# EasyEDA Pro project EasyEDA NeuroHab CS Module Project.epro

# Schematic Schematic1
Board Name: Board1; Create Date: 2025-11-24; Page Name: P1; Project Name: NH-AI CS Module; Schematic Name: Schematic1; Update Date: 2025-11-24; Company: EasyEDA.com; Page Size: A4; Version: V1.0
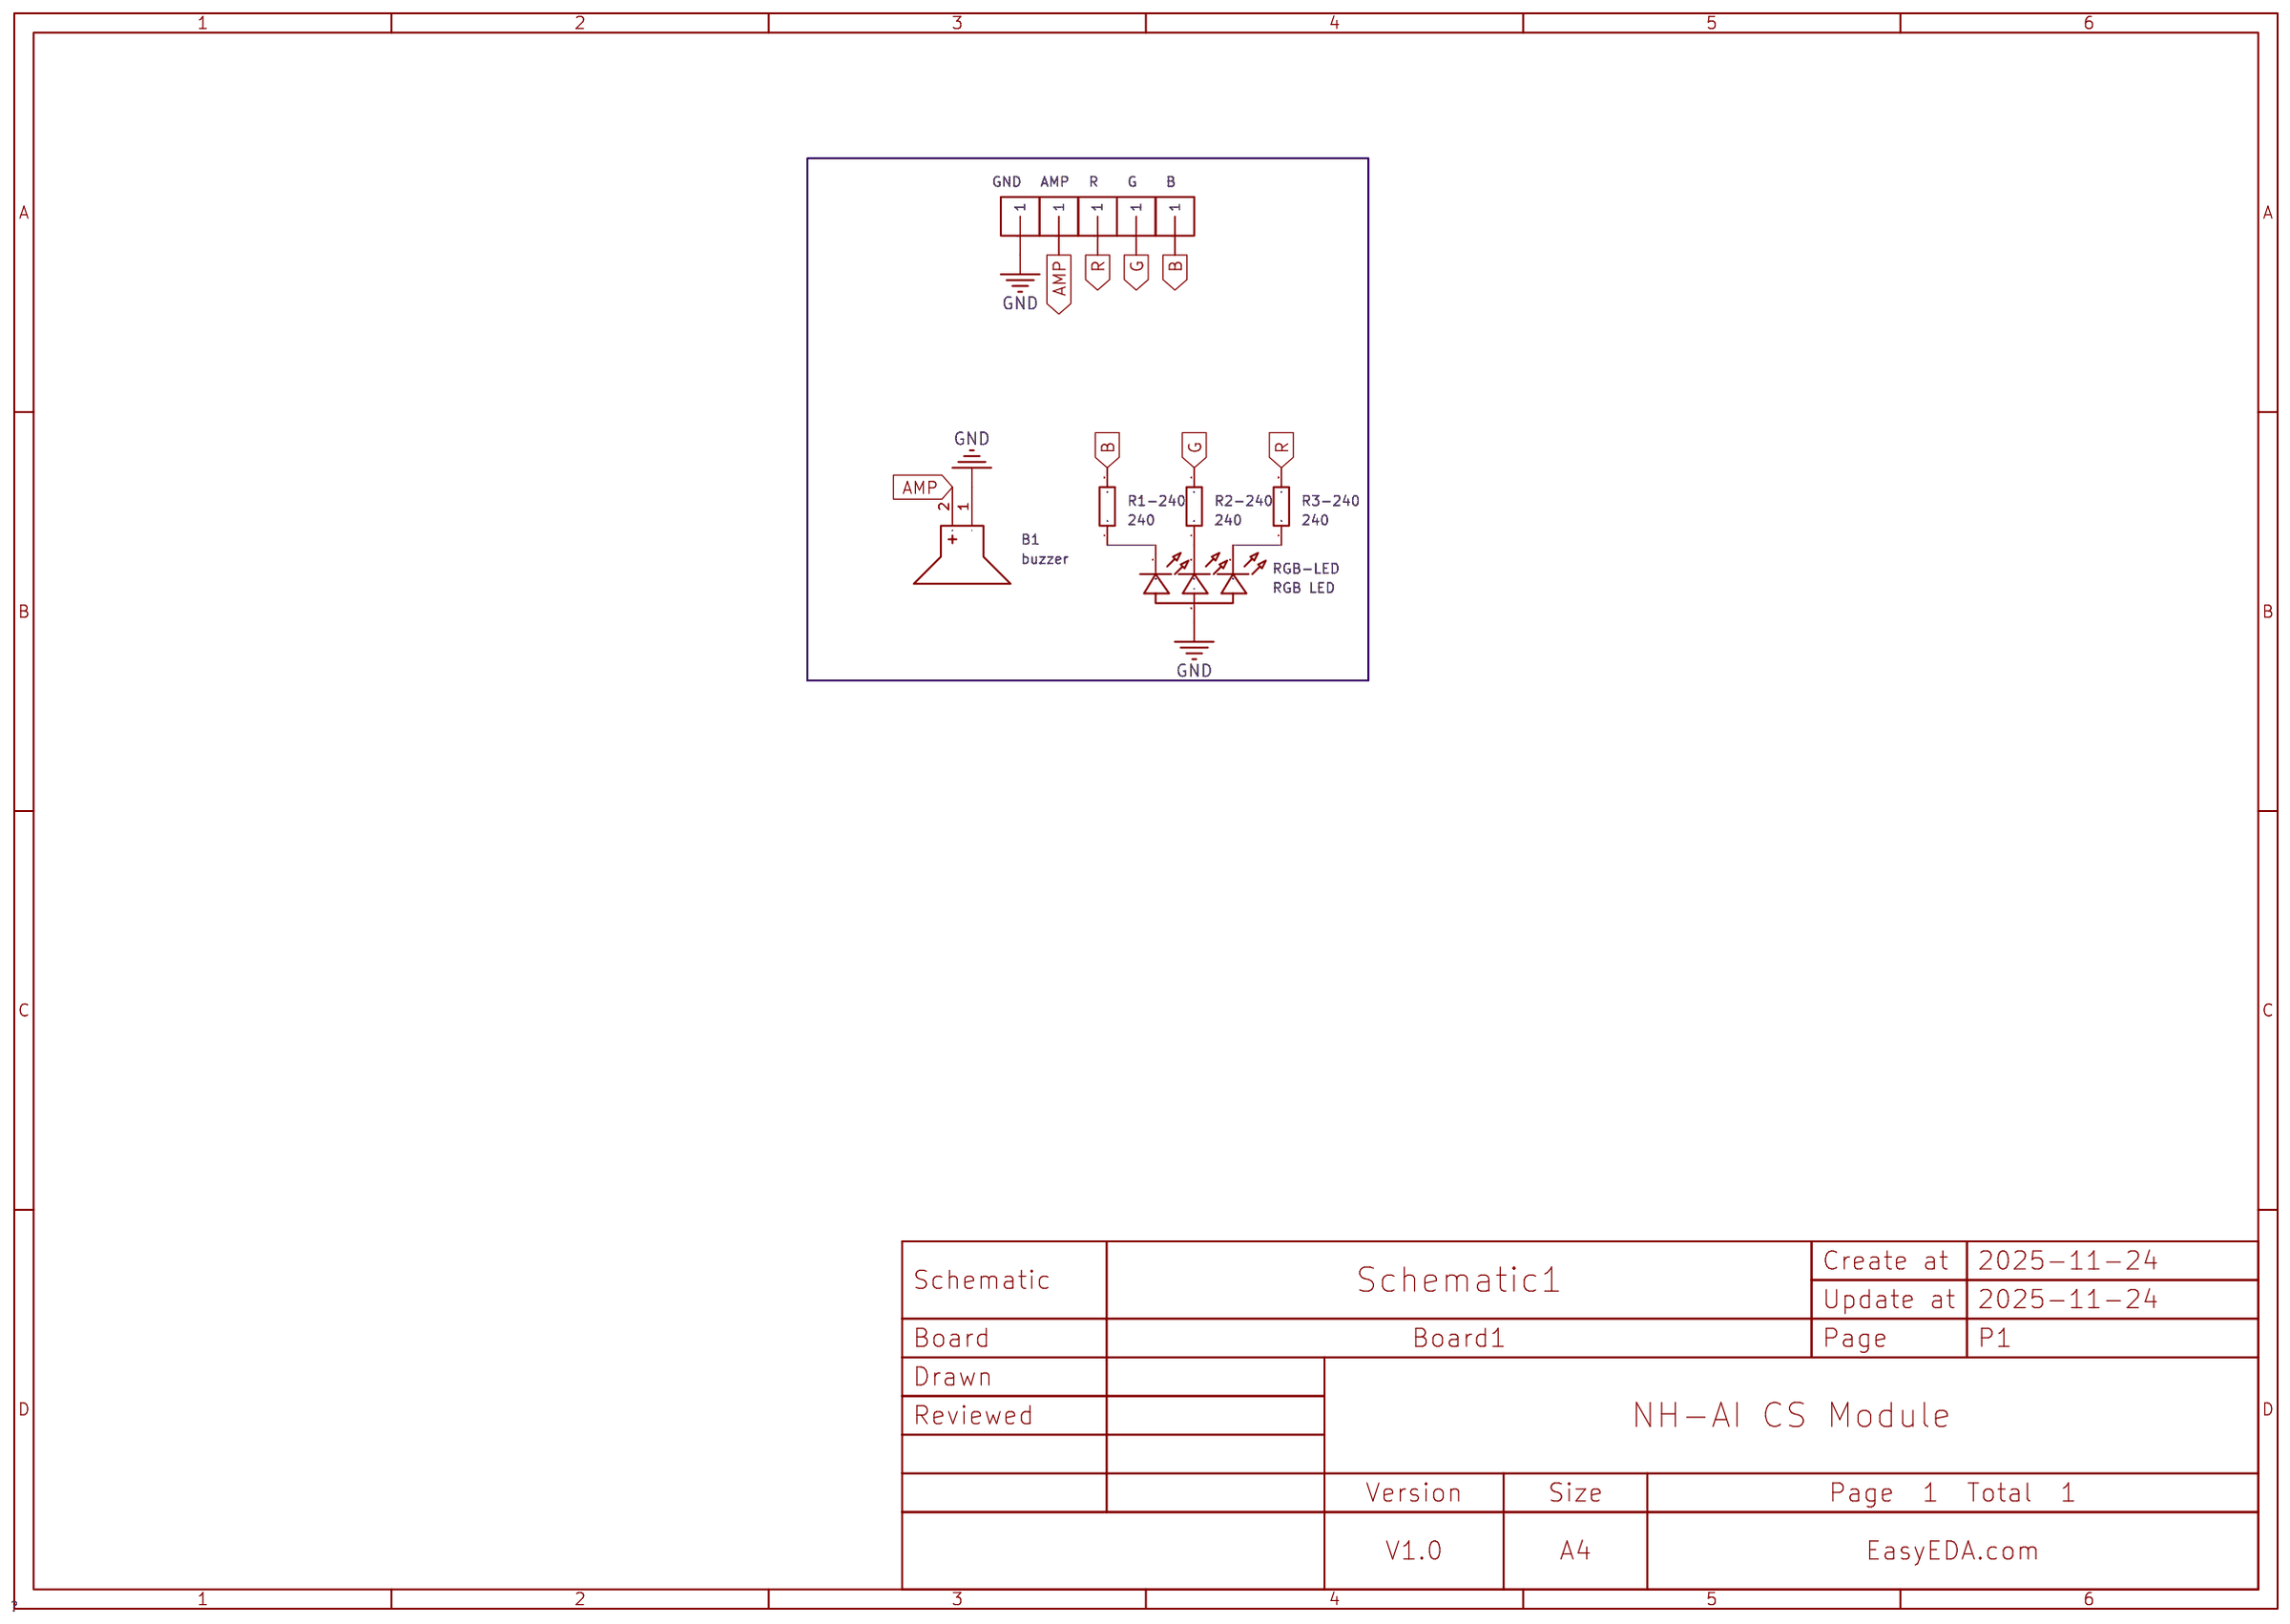
[diagram p0: schematic sheet]

## Parts
AMP  -  [2.54mm Screw Terminal]
B  -  [2.54mm Screw Terminal]
B1  buzzer  [BUZ-TH_BD12.0-P6.00-D0.9-RD]
G  -  [2.54mm Screw Terminal]
GND  -  [2.54mm Screw Terminal]
R  -  [2.54mm Screw Terminal]
R1-240  240  [R0603]
R2-240  240  [R0603]
R3-240  240  [R0603]
RGB-LED  RGB LED  [LED-TH_4P-BD5.8-P1.25_SL-BUXG6B1294-A]

## Library data of the parts
AMP B G GND R = 2.54mm Screw Terminal Block
B1 = buzzer: Supplier Part: C9900014030; JLCPCB Part Class: Extended Part; Supplier: LCSC
R1-240 R2-240 R3-240 = Res_0603: Supplier Footprint: 0603
RGB-LED = SL-BUXG6B1294-A: Supplier Part: C9900062918; Supplier Footprint: LED-TH-4P-RGB; JLCPCB Part Class: Extended Part; Supplier: LCSC

## Nets
GND: B1.1(-) GND.1 RGB-LED.2(A)
AMP: AMP.1 B1.2(+)
B: B.1 R1-240.2
G: G.1 R2-240.2
R: R.1 R3-240.2
$1N424: R1-240.1 RGB-LED.4(C)
$1N428: R3-240.1 RGB-LED.1(C)
$1N450: R2-240.1 RGB-LED.3(C)

# Board PCB1
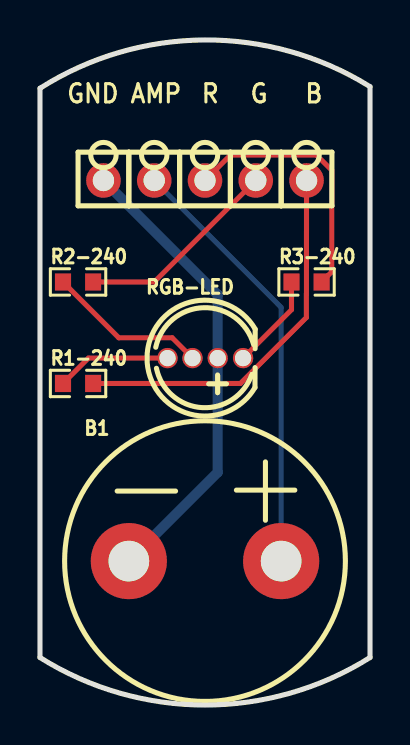
[diagram p1: board, top side]
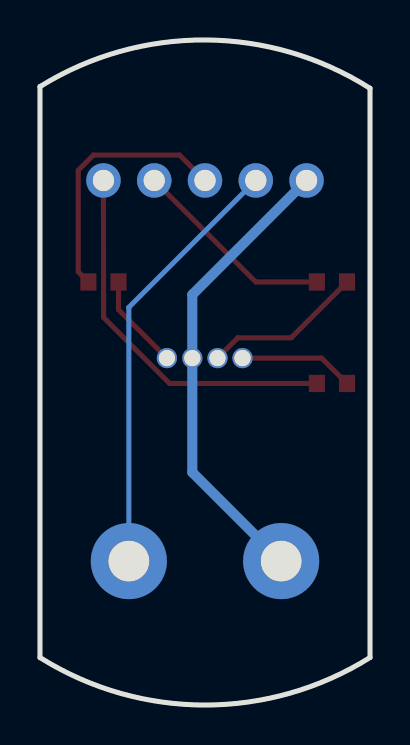
[diagram p2: board, bottom side, seen from below]

Outline 16.51 x 33.28 mm; copper layers: Top Layer, Bottom Layer. Coordinates in mm from the lower left corner of the outline.
Outline path: 0,30.87 arc(8.24,33.28) 16.51,30.95 16.51,2.38 arc(8.25,0) 0,2.38 0,30.87
Stack: Top Layer 0.035mm / Dielectric1 1.51mm FR4 er 4.5 / Bottom Layer 0.035mm

## Design rules (mm)
spacing copperThickness1oz (default): track to track 0.102, other pairs 0.152 to 0.3
spacing copperThickness2oz: track to track 0.203, other pairs 0.152 to 0.3
spacing Plane_innerPlane: track to track 0.102, other pairs 0.152 to 0.3
spacing Copper_copperRegion: track to track 0.102, other pairs 0.152 to 0.3
track width copperThickness1oz (default): min 0.127, default 0.254, max 2.54
track width copperThickness2oz: min 0.203, default 0.508, max 2.54
differential pair differentialPair (default): width min 0.127, default 0.254, max 2.54; gap min 0.152, default 0.152
net GND uses copperThickness2oz

## Placement (name value [footprint] x y rotation side)
AMP  -  [2.54mm Screw Terminal]  5.72 26.25 0 top
B  -  [2.54mm Screw Terminal]  13.34 26.25 0 top
B1  buzzer  [BUZ-TH_BD12.0-P6.00-D0.9-RD]  8.25 7.2 0 top
G  -  [2.54mm Screw Terminal]  10.79 26.25 0 top
GND  -  [2.54mm Screw Terminal]  3.18 26.25 0 top
R  -  [2.54mm Screw Terminal]  8.25 26.25 0 top
R1-240  240  [R0603]  1.91 16.09 0 top
R2-240  240  [R0603]  1.91 21.17 0 top
R3-240  240  [R0603]  13.34 21.17 0 top
RGB-LED  RGB LED  [LED-TH_4P-BD5.8-P1.25_SL-BUXG6B1294-A]  8.25 17.36 0 top

## Footprints (pads in the part's own frame, mm; a bottom-side part is the same pattern mirrored in y, then rotated)
2.54mm Screw Terminal
  round 1.727 hole 1.067: 1(0,0)
BUZ-TH_BD12.0-P6.00-D0.9-RD
  round 3.81 hole 2.032: 1(-3.81,0) 2(3.81,0)
LED-TH_4P-BD5.8-P1.25_SL-BUXG6B1294-A
  round 1.016 hole 0.813x0.762: 1(1.905,0) 2(0.635,0) 3(-0.625,0) 4(-1.875,0)
R0603
  rect 0.806x0.864 smd: 1(-0.753,0) 2(0.753,0)

## Nets
As in the schematic.

## Routing (per net, layer and track width the routed paths; a pad name or vN(x,y) marks a point on that pad's centre or on a via; arc(x,y) is an arc through that point)
GND: length 23.3
  Bottom Layer w0.508: B1.1 8.89,11.65 RGB-LED.2 8.89,20.54 GND.1
AMP: length 21.7
  Bottom Layer w0.254: AMP.1 12.06,19.9 B1.2
B: length 18.9
  Top Layer w0.254: R1-240.2 10.02,16.09 13.33,19.4 B.1
G: length 10.2
  Top Layer w0.254: R2-240.2 5.72,21.17 G.1
R: length 13
  Top Layer w0.254: R.1 9.53,27.52 13.83,27.52 14.6,26.76 14.6,21.68 R3-240.2
$1N424: length 5.8
  Top Layer w0.254: R1-240.1 2.42,17.36 RGB-LED.4
$1N428: length 4.8
  Top Layer w0.254: R3-240.1 12.58,19.78 RGB-LED.1
$1N450: length 8.1
  Top Layer w0.254: R2-240.1 3.95,18.38 6.61,18.38 RGB-LED.3
